# EAGLE design flip_dot_controller V2 - (EAGLE 7.2.0)
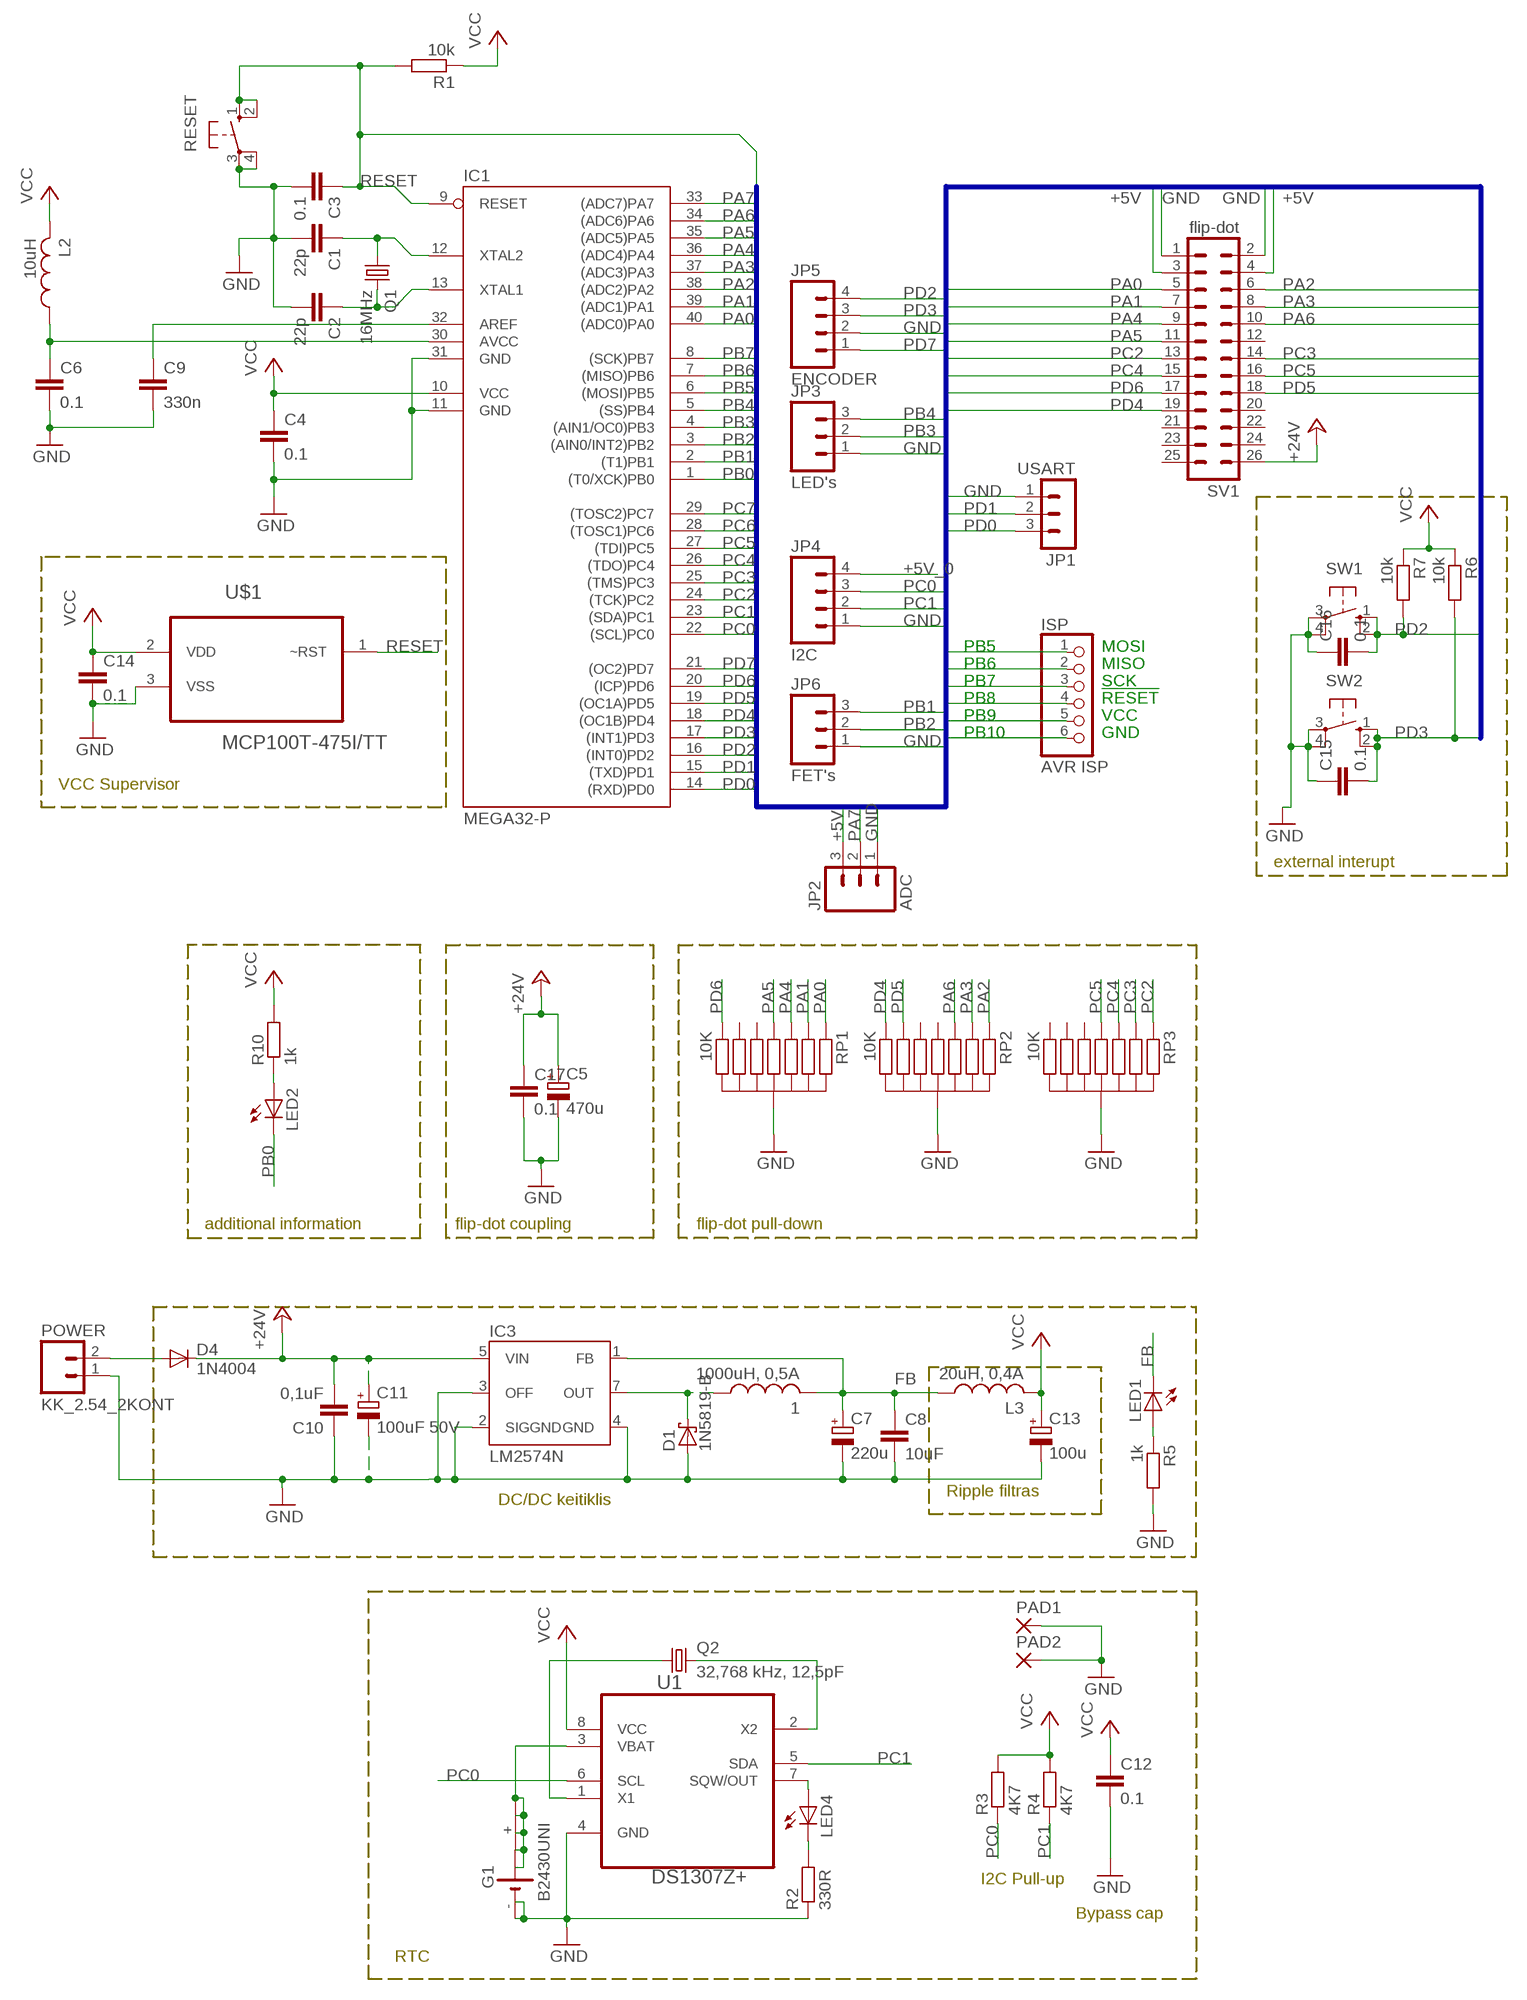
[diagram p0: schematic, sheet 1]

## Parts
1  1000uH, 0,5A  RITE1  [RITE]
C1  22p  C-EUC0805  [C0805]
C2  22p  C-EUC0805  [C0805]
C3  0.1  C-EUC0805  [C0805]
C4  0.1  C-EUC0805K  [C0805K]
C5  470u  CPOL-EUE5-10.5  [E5-10,5]
C6  0.1  C-EUC0805K  [C0805K]
C7  220u  CPOL-EUE5-8.5  [E5-8,5]
C8  10uF  C-EUC0805  [C0805]
C9  330n  C-EUC0805  [C0805]
C10  0,1uF  C-EUC0805K  [C0805K]
C11  100uF 50V  CPOL-EUE5-10.5  [E5-10,5]
C12  0.1  C-EUC0805  [C0805]
C13  100u  CPOL-EUE5-8.5  [E5-8,5]
C14  0.1  C-EUC0805K  [C0805K]
C15  0.1  C-EUC0805K  [C0805K]
C16  0.1  C-EUC0805K  [C0805K]
C17  0.1  C-EUC0805  [C0805]
D1  1N5819-B  [DO41-7.6]
D4  1N4004  [DO41-10]
G1  B2430UNI  [B2430UNI]
IC1  MEGA32-P  MEGA16-P  [DIL40]
IC3  LM2574N  [DIL-08]
ISP  AVR ISP  PINHD-1X6  [1X06]
JP1  USART  MA03-1  [MA03-1]
JP2  ADC  M03LOCK  [1X03_LOCK]
JP3  LED's  M03LOCK  [1X03_LOCK]
JP4  I2C  M04LOCK  [1X04_LOCK]
JP5  ENCODER  M04LOCK  [1X04_LOCK]
JP6  FET's  M03LOCK  [1X03_LOCK]
L2  10uH  L-US0207/5V  [0207/5V]
L3  20uH, 0,4A  L-US0207/5V  [0207/5V]
LED1  LED3MM  [LED3MM]
LED2  LED3MM  [LED3MM]
LED4  LED3MM  [LED3MM]
PAD1  2,15/1,0  [2,15/1,0]
PAD2  2,15/1,0  [2,15/1,0]
POWER  KK_2.54_2KONT  [KONTAKTINE_KALADELE_2.54_2KONT]
Q1  16MHz  CRYSTALHC49S  [HC49/S]
Q2  32,768 kHz, 12,5pF  CRYSTALTC38H  [TC38H]
R1  10k  R-EU_R0805  [R0805]
R2  330R  R-EU_R0805  [R0805]
R3  4K7  R-EU_R0805  [R0805]
R4  4K7  R-EU_R0805  [R0805]
R5  1k  R-EU_R0805  [R0805]
R6  10k  R-EU_R0805  [R0805]
R7  10k  R-EU_R0805  [R0805]
R10  1k  R-EU_R0805  [R0805]
RESET  10-XX  [B3F-10XX]
RP1  10K  1X8_RES_PACK  [1X8_RES_PACK]
RP2  10K  1X8_RES_PACK  [1X8_RES_PACK]
RP3  10K  1X8_RES_PACK  [1X8_RES_PACK]
SV1  flip-dot  ML263M  [3M_26]
SW1  10-XX  [B3F-10XX]
SW2  10-XX  [B3F-10XX]
U1  DS1307Z+  [SOIC127P600X175-8N]
U$1  MCP100T-475I/TT  [SOT95P237X112-3N]

## Nets
+5V: C4.1 C12.1 C13.+ C14.1 IC1.10(VCC) ISP.5 JP2.3 L2.2 L3.2 R1.1 R3.2 R4.2 R6.1 R7.1 R10.2 SV1.3 SV1.4 U1.8(VCC) U$1.2(VDD) ; supply symbol labelled VCC
+5V_0: JP4.4
+24V: C5.+ C10.2 C11.+ C17.1 D4.C IC3.5(VIN) SV1.26
FB: 1.2 C7.+ C8.1 IC3.1(FB) L3.1 LED1.K(C)
GND: C1.2 C2.2 C3.2 C4.2 C5.- C6.2 C7.- C8.2 C9.2 C10.1 C11.- C12.2 C13.- C14.2 C15.1 C16.1 C17.2 D1.A G1.- G1.-@1(-) IC1.11(GND) IC1.31(GND) IC3.2(SIGGND) IC3.3(OFF) IC3.4(GND) ISP.6 JP1.1 JP2.1 JP3.1 JP4.1 JP5.2 JP6.1 PAD1.1(P) PAD2.1(P) POWER.1 R2.1 R5.2 RESET.3(P) RESET.4(P1) RP1.1 RP2.1 RP3.1 SV1.1 SV1.2 SW1.3(P) SW1.4(P1) SW2.3(P) SW2.4(P1) U1.4(GND) U$1.3(VSS)
N$1: C2.1 IC1.13(XTAL1) Q1.2
N$2: C1.1 IC1.12(XTAL2) Q1.1
N$3: C9.1 IC1.32(AREF)
N$4: C6.1 IC1.30(AVCC) L2.1
N$6: Q2.1 U1.1(X1)
N$7: D4.A POWER.2
N$9: Q2.2 U1.2(X2)
N$10: LED4.A U1.7(SQW/OUT)
N$12: LED4.K(C) R2.2
N$13: LED1.A R5.1
N$17: LED2.A R10.1
OUT: 1.1 D1.C IC3.7(OUT)
PA0: IC1.40((ADC0)PA0) RP1.2 SV1.5
PA1: IC1.39((ADC1)PA1) RP1.3 SV1.7
PA2: IC1.38((ADC2)PA2) RP2.2 SV1.6
PA3: IC1.37((ADC3)PA3) RP2.3 SV1.8
PA4: IC1.36((ADC4)PA4) RP1.4 SV1.9
PA5: IC1.35((ADC5)PA5) RP1.5 SV1.11
PA6: IC1.34((ADC6)PA6) RP2.4 SV1.10
PA7: IC1.33((ADC7)PA7) JP2.2
PB0: IC1.1((T0/XCK)PB0) LED2.K(C)
PB1: IC1.2((T1)PB1) JP6.3
PB2: IC1.3((AIN0/INT2)PB2) JP6.2
PB3: IC1.4((AIN1/OC0)PB3) JP3.2
PB4: IC1.5((SS)PB4) JP3.3
PB5: IC1.6((MOSI)PB5) ISP.1
PB6: IC1.7((MISO)PB6) ISP.2
PB7: IC1.8((SCK)PB7) ISP.3
PC0: IC1.22((SCL)PC0) JP4.3 R3.1 U1.6(SCL)
PC1: IC1.23((SDA)PC1) JP4.2 R4.1 U1.5(SDA)
PC2: IC1.24((TCK)PC2) RP3.2 SV1.13
PC3: IC1.25((TMS)PC3) RP3.3 SV1.14
PC4: IC1.26((TDO)PC4) RP3.4 SV1.15
PC5: IC1.27((TDI)PC5) RP3.5 SV1.16
PC6: IC1.28((TOSC1)PC6)
PC7: IC1.29((TOSC2)PC7)
PD0: IC1.14((RXD)PD0) JP1.3
PD1: IC1.15((TXD)PD1) JP1.2
PD2: C16.2 IC1.16((INT0)PD2) JP5.4 R7.2 SW1.1(S) SW1.2(S1)
PD3: C15.2 IC1.17((INT1)PD3) JP5.3 R6.2 SW2.1(S) SW2.2(S1)
PD4: IC1.18((OC1B)PD4) RP2.8 SV1.19
PD5: IC1.19((OC1A)PD5) RP2.7 SV1.18
PD6: IC1.20((ICP)PD6) RP1.8 SV1.17
PD7: IC1.21((OC2)PD7) JP5.1
RESET: C3.1 IC1.9(RESET) ISP.4 R1.2 RESET.1(S) RESET.2(S1) U$1.1(~RST)
VBAT: G1.+ G1.+@1(+) G1.+@2(+) G1.+@3(+) G1.+@4(+) U1.3(VBAT)
Unconnected: RP1.6 RP1.7 RP2.5 RP2.6 RP3.6 RP3.7 RP3.8 SV1.12 SV1.20 SV1.21 SV1.22 SV1.23 SV1.24 SV1.25

## Buses
VCC,GND,VCON,CS1,CS2,RESET,R/W,D/I,EN,VEE,GLED,MISO,SCK,RESET,MOSI,RXD,TXD,PA[0..7],PB[0..7],PC[0..7],PD[0..7]

## Notes on the sheet
- PB5 | MOSI
- PB6 | MISO
- PB7 | SCK
- PB8 | !RESET
- PB9 | VCC
- PB10 | GND
- VCC Supervisor
- external interupt
- additional information | flip-dot coupling | flip-dot pull-down
- Ripple filtras
- DC/DC keitiklis
- I2C Pull-up
- Bypass cap
- RTC

## Library data of the parts
1 = cs5463:RITE
C1-C4 C6 C8-C10 C12 C14-C17 = rcl:C-EU: CAPACITOR, European symbol
C5 C7 C11 C13 = rcl:CPOL-EU: POLARIZED CAPACITOR, European symbol
D1 = diode:1N581*: 1.0A SCHOTTKY BARRIER RECTIFIER Source: http://www.diodes.com/datasheets/ds23001.pdf
D4 = diode:1N4004: DIODE general purpose rectifier, 1 A
G1 = battery:B2430UNI: LI BATTERY
IC1 = atmel:MEGA16-P: MICROCONTROLLER 16 Kbytes FLASH 1 kbytes SRAM 512 bytes EEPROM USART 8-channel 10 bit ADC Source: avr.lbr; MPN: ATMEGA16-16PU; OC_FARNELL: 9171142; OC_NEWARK: 01M6885
IC3 = v-reg-3:LM2574: National Semiconductor <http://www.national.com> 0.5A "Simple Switcher"(c) 52kHz, Vout 1.23-37V (HV: 57V), Vin 40V (HV: 60V), 50µA standby current
ISP = pinhead:PINHD-1X6: PIN HEADER
JP1 = con-lstb:MA03-1: PIN HEADER; OC_FARNELL: unknown; OC_NEWARK: unknown
JP2 JP3 JP6 = SparkFun:M03: Header 3 Standard 3-pin 0.1" header. Use with straight break away headers (SKU : PRT-00116), right angle break away headers (PRT-00553), swiss pins (PRT-00743), machine pins (PRT-00117), and female headers (PRT-00115). Molex polarized connector foot print use with SKU : PRT-08232 with associated crimp pins and housings.
JP4 JP5 = SparkFun:M04: Header 4 Standard 4-pin 0.1" header. Use with straight break away headers (SKU : PRT-00116), right angle break away headers (PRT-00553), swiss pins (PRT-00743), machine pins (PRT-00117), and female headers (PRT-00115). Molex polarized connector foot print use with SKU : PRT-08231 with associated crimp pins and housings. 1MM SMD Version SKU: PRT-10208
L2 L3 = rcl:L-US: INDUCTOR, American symbol
LED1 LED2 LED4 = led:LED: LED OSRAM: - CHIPLED LG R971, LG N971, LY N971, LG Q971, LY Q971, LO R971, LY R971 LH N974, LH R974 LS Q976, LO Q976, LY Q976 LO Q996 - Hyper CHIPLED LW Q18S LB Q993, LB Q99A, LB R99A - SideLED LS A670, LO A670, LY A670, LG A670, LP A670 LB A673, LV A673, LT A673, LW A673 LH A674 LY A675 LS A676, LA A676, LO A676, LY A676, LW A676 LS A679, LY A679, LG A679 - Hyper Micro SIDELED® LS Y876, LA Y876, LO Y876, LY Y876 LT Y87S - SmartLED LW L88C, LW L88S LB L89C, LB L89S, LG L890 LS L89K, LO L89K, LY L89K LS L896, LA L896, LO L896, LY L896 - TOPLED LS T670, LO T670, LY T670, LG T670, LP T670 LSG T670, LSP T670, LSY T670, LOP T670, LYG T670 LG T671, LOG T671, LSG T671 LB T673, LV T673, LT T673, LW T673 LH T674 LS T676, LA T676, LO T676, LY T676, LB T676, LH T676, LSB T676, LW T676 LB T67C, LV T67C, LT T67C, LS T67K, LO T67K, LY T67K, LW E67C LS E67B, LA E67B, LO E67B, LY E67B, LB E67C, LV E67C, LT E67C LW T67C LS T679, LY T679, LG T679 LS T770, LO T770, LY T770, LG T770, LP T770 LB T773, LV T773, LT T773, LW T773 LH T774 LS E675, LA E675, LY E675, LS T675 LS T776, LA T776, LO T776, LY T776, LB T776 LHGB T686 LT T68C, LB T68C - Hyper Mini TOPLED® LB M676 - Mini TOPLED Santana® LG M470 LS M47K, LO M47K, LY M47K Source: http://www.osram.convergy.de LUXEON: - LUMILED® LXK2-PW12-R00, LXK2-PW12-S00, LXK2-PW14-U00, LXK2-PW14-V00 LXK2-PM12-R00, LXK2-PM12-S00, LXK2-PM14-U00 LXK2-PE12-Q00, LXK2-PE12-R00, LXK2-PE12-S00, LXK2-PE14-T00, LXK2-PE14-U00 LXK2-PB12-K00, LXK2-PB12-L00, LXK2-PB12-M00, LXK2-PB14-N00, LXK2-PB14-P00, LXK2-PB14-Q00 LXK2-PR12-L00, LXK2-PR12-M00, LXK2-PR14-Q00, LXK2-PR14-R00 LXK2-PD12-Q00, LXK2-PD12-R00, LXK2-PD12-S00 LXK2-PH12-R00, LXK2-PH12-S00 LXK2-PL12-P00, LXK2-PL12-Q00, LXK2-PL12-R00 Source: www.luxeon.com KINGBRIGHT: KA-3528ASYC Source: www.kingbright.com
PAD1 PAD2 = wirepad:2,15/1,0: THROUGH-HOLE PAD
POWER = ExT:KK_2.54_2KONT
Q1 = crystal:CRYSTAL: CRYSTAL; OC_FARNELL: 1667008; OC_NEWARK: unknown
Q2 = crystal:CRYSTAL: CRYSTAL; OC_FARNELL: unknown; OC_NEWARK: unknown
R1-R7 R10 = rcl:R-EU_: RESISTOR, European symbol
RESET SW1 SW2 = switch-omron:10-XX: OMRON SWITCH; MPN: B3F-1000; OC_FARNELL: 176432; OC_NEWARK: 36M3542
RP1-RP3 = ExT:1X8_RES_PACK
SV1 = con-harting-ml:ML26: HARTING; OC_FARNELL: unknown; OC_NEWARK: unknown
U1 = ds1307:DS1307Z+: 64 x 8, Serial, I2C Real-Time Clock; MPN: DS1307Z+; OC_FARNELL: 9726322; OC_NEWARK: 08J6234; PACKAGE: SOIC-8; SUPPLIER: Maxim
U$1 = MCP100T:MCP100T-475I/TT: Microcontroller Supervisory Circuit; MPN: MCP100T-475I/TT; OC_FARNELL: 9758380; OC_NEWARK: 19C7132; PACKAGE: SOT-3; SUPPLIER: Microchip

## Board
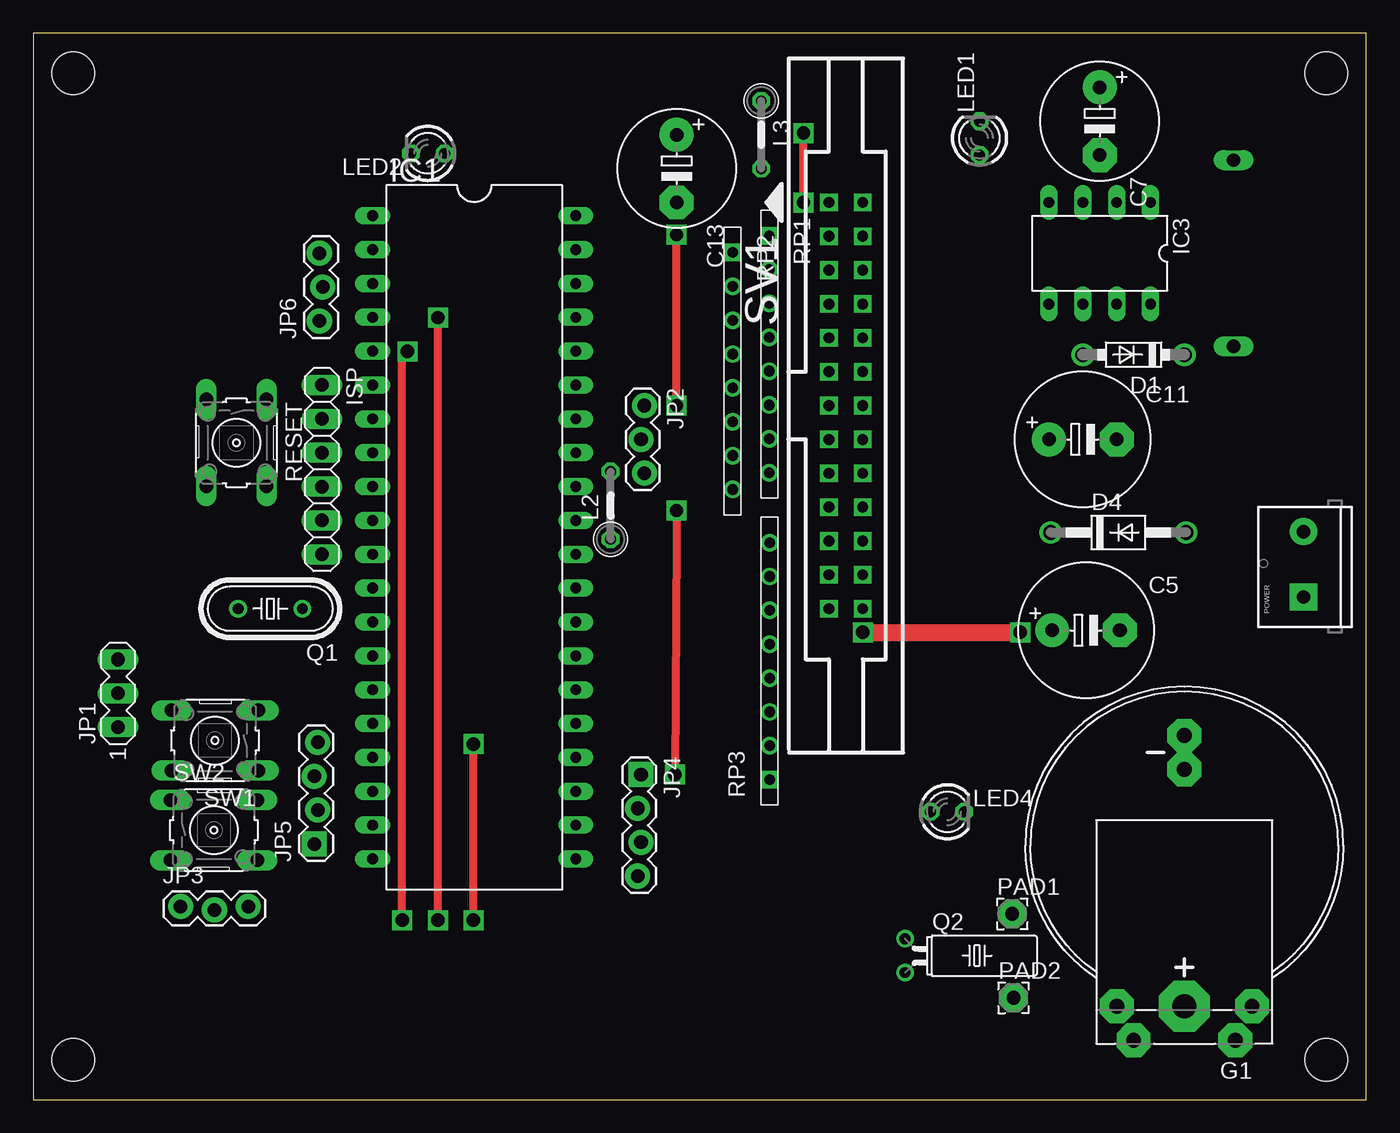
[diagram p1: board, top side]
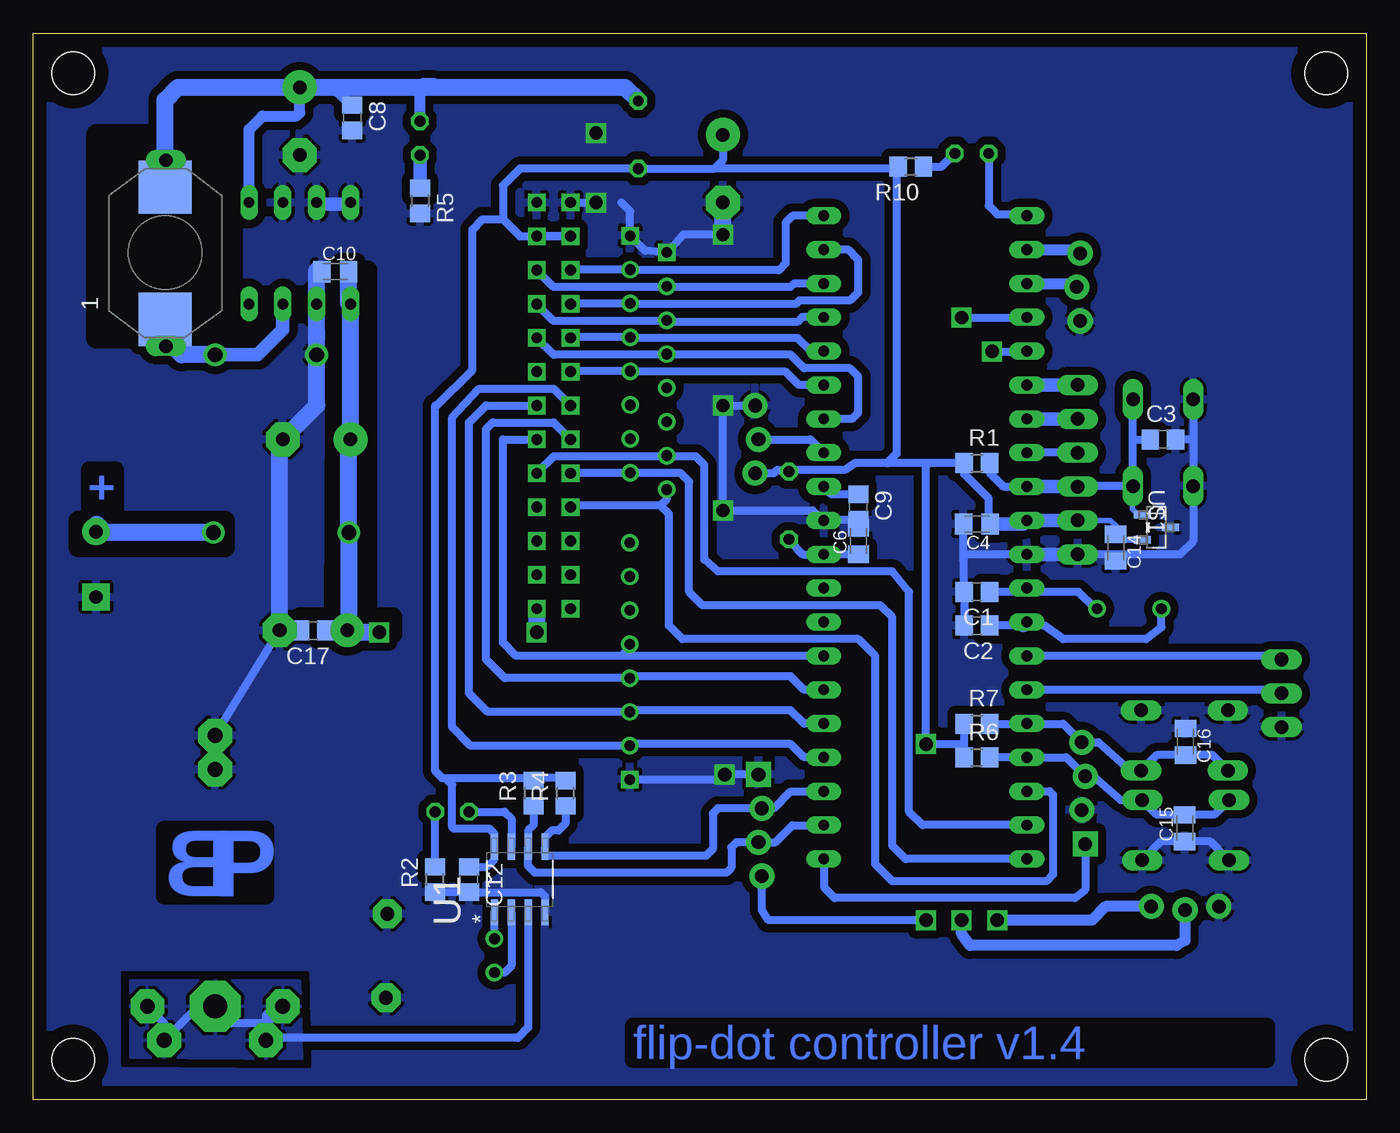
[diagram p2: board, bottom side, seen from below]

Size 100 x 80 mm. Coordinates in mm from the lower left corner, seen from the top.
Outline: 0,0 100,0 100,80 0,80 0,0
Copper layers (1*16): Top 0.035mm / dielectric 1.5mm / Bottom 0.035mm
Design rules "default": minimum track width 10mil, minimum drill 24mil, track to track 8mil, track to pad 8mil, pad to pad 8mil, via to via 8mil, smd to smd 8mil, copper to edge 40mil, drill to drill 8mil, minimum pad ring 10mil, minimum via ring 8mil, stop-mask expansion 4mil, vias tented up to drill 0mil, thermal gap 10mil
Holes 3.2 mm at 97,3 97,77 3,77 3,3
bRestrict: area 85.1,57.1 to 95.2,72.4; area 85.6,41.4 to 96.6,43.4; area 74.9,36.2 to 77.5,59.8; area 74.9,59.7 to 77.5,62.2; area 73,34.9 to 80,36.2

### Footprints (pad centres in the part's own frame; a part is rotated, then mirrored left to right if it is on the bottom)
RITE = smd 4 x 4: 1 1.4,0.7; 2 11.3,0.7 | drill 1 long: 1_1 -0.635,0.635; 2_2 13.335,0.635
C0805 = smd 1.3 x 1.5: 1 -0.95,0; 2 0.95,0
C0805K = smd 1.3 x 1.6: 1 -1,0; 2 1,0
E5-10,5 = drill 1.016 pad 2.54: + -2.54,0 | drill 1.016 pad 2.54 octagon: - 2.54,0
E5-8,5 = drill 1.016 pad 2.54: + -2.54,0 | drill 1.016 pad 2.54 octagon: - 2.54,0
DO41-7.6 = drill 1.1 pad 1.7: A 3.81,0; C -3.81,0
DO41-10 = drill 1.118: A 5.08,0; C -5.08,0
B2430UNI = drill 1.118 pad 2.54 octagon: + 3.81,14.605; +@1 -3.81,14.605; +@2 -5.08,12.065; +@3 5.08,12.065; - 0,-5.715; -@1 0,-8.255 | drill 1.803 pad 3.81 octagon: +@4 0,12.065
DIL40 = drill 0.813 long: 1 -24.13,-7.62; 2 -21.59,-7.62; 3 -19.05,-7.62; 4 -16.51,-7.62; 5 -13.97,-7.62; 6 -11.43,-7.62; 7 -8.89,-7.62; 8 -6.35,-7.62; 9 -3.81,-7.62; 10 -1.27,-7.62; 11 1.27,-7.62; 12 3.81,-7.62; 13 6.35,-7.62; 14 8.89,-7.62; 15 11.43,-7.62; 16 13.97,-7.62; 17 16.51,-7.62; 18 19.05,-7.62; 19 21.59,-7.62; 20 24.13,-7.62; 21 24.13,7.62; 22 21.59,7.62; 23 19.05,7.62; 24 16.51,7.62; 25 13.97,7.62; 26 11.43,7.62; 27 8.89,7.62; 28 6.35,7.62; 29 3.81,7.62; 30 1.27,7.62; 31 -1.27,7.62; 32 -3.81,7.62; 33 -6.35,7.62; 34 -8.89,7.62; 35 -11.43,7.62; 36 -13.97,7.62; 37 -16.51,7.62; 38 -19.05,7.62; 39 -21.59,7.62; 40 -24.13,7.62
DIL-08 = drill 0.813 long: 1 -3.81,-3.81; 2 -1.27,-3.81; 3 1.27,-3.81; 4 3.81,-3.81; 5 3.81,3.81; 6 1.27,3.81; 7 -1.27,3.81; 8 -3.81,3.81
1X06 = drill 1.016 long: 1 -6.35,0; 2 -3.81,0; 3 -1.27,0; 4 1.27,0; 5 3.81,0; 6 6.35,0
MA03-1 = drill 1.016 long: 1 -2.54,0; 2 0,0; 3 2.54,0
1X03_LOCK = drill 1.016 pad 1.88: 1 0,0.127; 2 2.54,-0.127; 3 5.08,0.127
1X04_LOCK = drill 1.016 pad 1.88 square: 1 0,0.127 | drill 1.016 pad 1.88: 2 2.54,-0.127; 3 5.08,0.127; 4 7.62,-0.127
0207/5V = drill 0.813 octagon: 1 -2.54,0; 2 2.54,0
LED3MM = drill 0.813 octagon: A -1.27,0; K 1.27,0
2,15/1,0 = drill 1.016 pad 2.159 octagon: 1 0,0
KONTAKTINE_KALADELE_2.54_2KONT = drill 1 pad 2.032 square: 1 0,0 | drill 1 pad 2.032: 2 4.9,0
HC49/S = drill 0.813: 1 -2.413,0; 2 2.413,0
TC38H = drill 0.813: 1 -1.27,0; 2 1.27,0
R0805 = smd 1.3 x 1.5: 1 -0.95,0; 2 0.95,0
B3F-10XX = drill 1.016 long: 1 -3.251,2.261; 2 3.251,2.261; 3 -3.251,-2.261; 4 3.251,-2.261
1X8_RES_PACK = drill 0.8 square: 1 0,0 | drill 0.8: 2 2.54,0; 3 5.08,0; 4 7.62,0; 5 10.16,0; 6 12.7,0; 7 15.24,0; 8 17.78,0
3M_26 = drill 0.813 square: 1 -15.24,-1.27; 2 -15.24,1.27; 3 -12.7,-1.27; 4 -12.7,1.27; 5 -10.16,-1.27; 6 -10.16,1.27; 7 -7.62,-1.27; 8 -7.62,1.27; 9 -5.08,-1.27; 10 -5.08,1.27; 11 -2.54,-1.27; 12 -2.54,1.27; 13 0,-1.27; 14 0,1.27; 15 2.54,-1.27; 16 2.54,1.27; 17 5.08,-1.27; 18 5.08,1.27; 19 7.62,-1.27; 20 7.62,1.27; 21 10.16,-1.27; 22 10.16,1.27; 23 12.7,-1.27; 24 12.7,1.27; 25 15.24,-1.27; 26 15.24,1.27
SOIC127P600X175-8N = smd 1.981 x 0.533: 1 -2.464,1.905; 2 -2.464,0.635; 3 -2.464,-0.635; 4 -2.464,-1.905; 5 2.464,-1.905; 6 2.464,-0.635; 7 2.464,0.635; 8 2.464,1.905
SOT95P237X112-3N = smd 0.559 x 1.27: 1 -0.94,-1.041; 2 0.94,-1.041; 3 0,1.041

### Placement (x,y rotation side)
1  89.41,57.15 90 bottom
C1  29.21,38.1 180 bottom
C2  29.21,35.56 180 bottom
C3  15.24,49.53 0 bottom
C4  29.21,43.18 180 bottom
C5  78.98,35.21 0 top
C6  38.1,41.91 90 bottom
C7  80.01,73.41 270 top
C8  76.07,73.66 270 bottom
C9  38.1,44.45 270 bottom
C10  77.34,62.1 0 bottom
C11  78.74,49.53 0 top
C12  67.31,16.51 270 bottom
C13  48.26,69.85 270 top
C14  18.8,41.4 270 bottom
C15  13.62,20.36 90 bottom
C16  13.56,26.84 270 bottom
C17  78.99,35.18 180 bottom
D1  82.55,55.88 180 top
D4  81.41,42.55 0 top
G1  86.36,19.05 180 top
IC1  33.08,42.18 270 top
IC3  80.01,63.5 180 top
ISP  21.65,47.26 270 top
JP1  6.35,30.48 90 top
JP2  45.72,52.07 270 top
JP3  11.05,14.35 0 top
JP4  45.47,24.38 270 top
JP5  21.21,19.18 90 top
JP6  21.59,58.42 90 top
L2  43.31,44.58 90 top
L3  54.61,72.39 270 top
LED1  70.99,72.14 90 top
LED2  29.59,70.99 180 top
LED4  68.58,21.59 0 top
PAD1  73.44,13.93 0 top
PAD2  73.54,7.63 0 top
POWER  95.3,37.71 90 top
Q1  17.78,36.83 180 top
Q2  65.41,10.79 270 top
R1  29.21,47.75 0 bottom
R2  69.85,16.51 90 bottom
R3  62.48,22.99 90 bottom
R4  60.07,22.99 90 bottom
R5  70.99,67.44 270 bottom
R6  29.21,25.65 0 bottom
R7  29.21,28.19 0 bottom
R10  34.16,69.98 180 bottom
RESET  15.24,49.28 270 top
RP1  55.22,64.81 270 top
RP2  52.47,63.55 270 top
RP3  55.24,24 90 top
SV1  60.96,52.07 270 top
SW1  13.63,26.94 180 top
SW2  13.55,20.21 0 top
U1  63.5,16.51 90 bottom
U$1  15.75,42.93 270 bottom

### Tracks (layer width: path | path; a pad name or v marks a point on that pad's centre or on a via)
+5V  (via drill 1)
  Top 0.61: v33.02,13.46 v33.02,26.67
  Bottom 0.406: U$1.2 18.38,41.99 C14.1 18.8,43.05 19.18,43.43 21.63,43.43 ISP.5
  Bottom 0.61: SV1.4 SV1.3 63.5,64.77 64.77,66.04 | R1.1 30.16,46.92 28.32,45.09 28.32,43.29 C4.1 | R1.1 33.02,47.75 | 33.02,47.75 35.94,47.75 | 35.94,47.75 38.35,47.75 39.12,47.24 43.43,47.24 | 64.77,66.04 64.77,68.58 63.5,69.85 L3.2 48.9,69.85 | R1.1 30.48,48.07 | 43.18,46.99 L2.2 43.43,47.24 | JP2.3 44.45,46.99 44.2,47.24 43.43,47.24 | C13.+ 48.26,70.48 48.9,69.85 | 33.02,47.75 32.89,47.62 33.02,47.62 v33.02,26.67 30.16,26.67 | C12.1 65.98,17.46 65.41,18.03 U1.8 65.41,19.94 65.79,20.32 68.45,20.32 68.58,20.45 68.58,23.62 69.09,24.13 | 69.85,51.94 67.06,54.74 67.06,65.28 66.29,66.04 64.77,66.04 | 69.85,51.94 69.85,24.64 69.34,24.13 69.09,24.13 | 69.85,51.94 69.85,52.07 | 69.09,24.13 62.29,24.13 | R4.2 60.26,24.13 62.29,24.13 | 62.29,24.13 R3.2 | 35.24,69.85 48.9,69.85 | R6.1 30.16,26.67 | 30.16,26.67 R7.1 | v33.02,13.46 44.83,13.46 45.34,14.22 45.34,16.38 45.59,16.64 45.47,16.76 | 35.24,69.85 R10.2 | 35.24,69.85 35.24,48.45 35.94,47.75
  Bottom 1.016: ISP.5 IC1.10 25.73,43.18 C4.1
+24V  (via drill 1)
  Top 1.27: v62.23,35.05 v74.04,35.05
  Bottom 1.27: C5.+ 76.44,35.94 77.2,35.18 C17.1 | C5.+ 76.33,35.32 D4.C 76.33,49.4 C11.+ IC3.5 76.34,59.69 C10.2 | SV1.26 v62.23,35.05 | v74.04,35.05 76.28,35.05 C5.+
FB
  Bottom 0.813: 80.01,76.07 C7.+ 80.01,74.04 80.26,73.79 82.8,73.79 83.82,72.77 IC3.1 | C8.1 77.34,75.82 77.47,75.95 | LED1.K 70.99,76.07 | 70.99,76.07 69.85,76.2 70.87,76.2 70.99,76.07 | 70.99,76.07 71.12,75.95
  Bottom 1.27: L3.1 55.63,75.95 71.12,75.95 77.47,75.95 C7.+ 89.15,75.95 90.11,74.99 1.2
GND  (via drill 1, 1 pad 0.81)
  Top 0.61: v48.13,24.38 48.26,42.04 v48.26,44.2 | v48.26,52.07 v48.26,64.9 | v57.78,67.31 v57.78,72.52
  Bottom 0.61: C2.2 C1.2 30.23,38.17 30.23,40.51 | 37.78,43.18 C9.2 | C9.2 40.65,43.5 IC1.31 40.72,43.43 40.77,43.43 41.53,44.2 v48.26,44.2 v48.26,52.07 45.72,52.07 | 55.88,67.31 55.22,66.65 RP1.1 54.09,63.68 RP2.1 51.25,64.9 v48.26,64.9 | C9.2 C6.2 | SW2.3 11.71,19.36 C15.1 15.39,19.36 SW2.4 | IC1.11 29.96,40.91 30.23,40.64 30.23,40.51 | C4.2 30.21,40.53 30.23,40.51 | ISP.6 21.63,40.89 13.97,40.89 12.98,41.88 RESET.4 12.98,49.53 | RESET.3 12.98,49.53 | 12.98,49.53 C3.2 | RP3.1 48.39,24 48.26,24.13 | 48.26,24.13 48.26,24.26 v48.13,24.38 | U1.4 61.59,15.24 61.91,15.56 C12.2 R2.1 69.85,15.24 | JP4.1 48.01,24.38 48.26,24.13 | C5.- 81.52,35.32 81.28,35.56 G1.-@1 G1.- | SV1.1 v57.78,67.31 | v57.78,72.52 57.78,72.77
  Bottom 1.016: ISP.6 IC1.11 | 78.61,67.18 76.33,67.18 IC3.4
  Bottom 1.27: C5.- 81.79,34.94 81.79,34.67 81.52,34.94 C5.- | C17.2 81.49,35.18 C5.- | v48.26,64.9 C13.- | C5.- 81.52,49.29 C11.- 78.74,52.07 D1.A 78.74,62.1 | C10.1 78.74,62.1 | 78.74,62.1 78.74,62.23
  pour Bottom (isolate 0.61, rank 6): 0,80.01 100.33,80.01 100.33,0 0,0
N$1
  Bottom 0.61: Q1.2 15.37,35.43 16.51,34.54 22.73,34.54 24.13,35.56 25.19,35.56 IC1.13 | 25.73,35.56 C2.1
  Bottom 1.016: IC1.13 25.73,35.56
N$2
  Bottom 0.61: 20.32,36.83 21.59,38.1 25.19,38.1 IC1.12 25.73,38.1 C1.1
  Bottom 1.016: Q1.1 20.32,36.83
N$3
  Bottom 0.61: C9.1 40.11,45.4 IC1.32
N$4
  Bottom 0.61: C6.1 IC1.30 40.72,40.89 42.29,40.89 42.67,41.27 L2.1
N$6
  Bottom 0.61: Q2.1 U1.1
N$7
  Bottom 1.27: D4.A 94.61,42.55 95.25,43.18 95.25,42.66 POWER.2
N$9
  Bottom 0.61: U1.2 64.14,10.03 64.64,9.53 Q2.2
N$10
  Bottom 0.61: LED4.A 64.64,21.59 64.14,21.08 U1.7
N$12
  Bottom 0.61: R2.2 LED4.K
N$13
  Bottom 1.016: R5.1 LED1.A
N$17
  Bottom 0.61: R10.1 31.88,69.98 LED2.A
OUT
  Bottom 1.016: D1.C 83.19,55.88 81.28,57.78 IC3.7
  Bottom 1.27: D1.C 88.9,55.88 90.17,57.15 90.17,58.42 90.11,58.48 1.1
PA0
  Bottom 0.61: IC1.40 43.04,66.31 43.56,65.79 43.56,62.74 44.07,62.23 55.18,62.23 RP1.2 59.65,62.27 SV1.5
PA1
  Bottom 0.61: IC1.39 40.68,63.75 38.86,63.75 38.1,62.99 38.1,60.58 38.73,59.94 42.55,59.94 42.8,59.69 55.18,59.69 RP1.3 59.65,59.73 SV1.7
PA2
  Bottom 0.61: IC1.38 42.91,61.23 43.18,60.96 52.29,60.96 RP2.2 52.52,61.14 52.7,60.96 60.96,60.96 SV1.6
PA3
  Bottom 0.61: IC1.37 42.34,58.69 42.68,58.35 52.22,58.35 RP2.3 52.65,58.6 52.83,58.42 60.96,58.42 SV1.8
PA4
  Bottom 0.61: IC1.36 41.67,56.15 42.67,57.15 55.18,57.15 RP1.4 59.65,57.19 SV1.9
PA5
  Bottom 0.61: IC1.35 42.56,53.61 43.56,54.61 55.18,54.61 RP1.5 59.65,54.65 SV1.11
PA6
  Bottom 0.61: IC1.34 38.59,51.07 38.1,51.56 38.1,54.23 38.73,54.86 42.16,54.86 43.18,55.88 52.29,55.88 RP2.4 52.65,56.06 52.83,55.88 60.96,55.88 SV1.10
PA7
  Bottom 0.61: JP2.2 41.7,49.53 IC1.33
PB0
  Bottom 0.61: LED2.K 28.32,67.06 27.69,66.42 25.57,66.42 IC1.1
PB1
  Bottom 0.813: IC1.2 21.73,63.77 JP6.3
PB2
  Bottom 0.813: IC1.3 21.99,61.23 JP6.2
PB3  (via drill 1)
  Top 0.61: v30.35,13.46 v30.35,58.67
  Bottom 0.61: v30.35,58.67 25.48,58.67 IC1.4
  Bottom 0.813: JP3.2 13.59,11.94 14.22,11.56 29.72,11.56 30.35,12.45 v30.35,13.46
PB4  (via drill 1)
  Top 0.61: v27.69,13.46 27.69,55.75 v28.07,56.13
  Bottom 0.61: v28.07,56.13 25.48,56.13 IC1.5
  Bottom 0.813: JP3.3 19.56,14.48 20.57,13.46 v27.69,13.46
PB5
  Bottom 1.016: ISP.1 IC1.6
PB6
  Bottom 1.016: ISP.2 IC1.7
PB7
  Bottom 0.61: ISP.3 25.42,48.53 | 25.42,48.53 25.53,48.64 | IC1.8 25.42,48.53
PC0
  Bottom 0.61: IC1.22 40.72,20.57 43.05,20.57 44.32,19.3 JP4.3 47.24,19.3 47.62,18.92 47.62,17.4 48.01,17.02 62.36,17.02 62.87,17.53 U1.6 62.87,20.19 62.48,20.57 R3.1
PC1
  Bottom 0.61: 45.21,21.84 JP4.2 48.64,21.84 49.02,21.46 49.02,18.8 49.53,18.29 61.47,18.29 61.59,18.41 U1.5 61.59,19.68 61.09,20.19 60.58,20.19 60.07,20.7 R4.1 | 45.21,21.84 44.45,21.84 43.18,23.11 40.72,23.11 IC1.23 | 45.34,21.97 45.21,21.84
PC2
  Bottom 0.61: IC1.24 42.18,25.67 43.18,26.67 55.12,26.67 RP3.2 67.18,26.54 68.58,27.94 68.58,51.18 66.55,53.34 60.96,53.34 SV1.13
PC3
  Bottom 0.61: IC1.25 42.18,28.21 43.18,29.21 55.12,29.21 RP3.3 65.91,29.08 67.31,30.48 67.31,50.8 66.04,52.07 SV1.14
PC4
  Bottom 0.61: IC1.26 42.18,30.75 43.18,31.75 55.12,31.75 RP3.4 64.64,31.62 66.04,33.02 66.04,50.29 65.53,50.8 60.96,50.8 SV1.15
PC5
  Bottom 0.61: SV1.16 64.77,49.53 64.77,34.29 63.77,33.29 55.88,33.29 | IC1.27 55.88,33.29 | RP3.5 55.24,33.92 55.88,33.29
PD0
  Bottom 0.61: IC1.14 6.62,33.29 JP1.3
PD1
  Bottom 0.61: IC1.15 6.62,30.75 JP1.2 6.28,30.55
PD2
  Bottom 0.61: R7.2 25.48,28.19 | 25.48,28.19 IC1.16 | 10.32,24.62 SW1.2 | SW1.2 11.54,25.84 C16.2 15.72,25.84 SW1.1 16.92,24.64 17.65,24.64 20.07,26.8 JP5.4 22.73,28.19 25.48,28.19 | 10.34,24.64 SW1.2 | 10.16,24.89 SW1.2 | 10.18,24.88 SW1.2
PD3
  Bottom 0.61: SW2.1 11.41,21.36 C15.2 15.69,21.36 SW2.2 18.41,22.48 20.45,24.26 JP5.3 22.5,25.67 IC1.17 28.24,25.67 R6.2
PD4
  Bottom 0.61: 52.96,44.58 52.32,43.94 52.32,35.56 51.31,34.54 38.1,34.54 36.83,33.27 36.83,17.65 35.56,16.38 24,16.38 23.5,16.89 23.5,22.86 23.77,23.13 IC1.18 | RP2.8 52.47,45.07 52.96,44.58 | 52.96,44.58 59.56,44.58 SV1.19
PD5
  Bottom 0.61: SV1.18 60.96,48.26 52.7,48.26 52.52,48.44 RP2.7 52.29,48.26 50.29,48.26 49.66,47.62 49.66,40.51 48.64,39.62 35.56,39.62 34.29,38.1 34.29,21.59 33.29,20.59 IC1.19
PD6
  Bottom 0.61: 55.18,46.99 51.44,46.99 50.8,46.35 50.8,38.1 49.78,37.08 36.45,37.08 35.56,36.2 35.56,19.05 34.56,18.05 IC1.20 | 55.18,46.99 RP1.8 | 55.18,46.99 SV1.17
PD7
  Bottom 0.61: IC1.21 40.64,17.99 40.64,15.88 39.88,15.11 21.84,15.11 21.08,15.75 JP5.1
RESET
  Bottom 0.406: U$1.1 17.07,43.87 17.53,44.32 17.53,45.97 17.5,46 | 17.5,46 17.4,46.1 | RESET.2 17.5,46
  Bottom 0.61: ISP.4 21.61,46.02 RESET.2 17.5,49.53 | 17.5,49.53 RESET.1 | 17.5,49.53 C3.1 | R1.2 28.26,47.06 27.18,45.97 25.48,45.97 IC1.9
  Bottom 1.016: ISP.4 IC1.9
VBAT
  Bottom 0.61: G1.+ 82.55,5.08 | 82.55,5.08 82.55,5.71 | 82.55,5.71 82.27,6 | 82.27,6 G1.+@3 | G1.+@2 90.17,5.71 G1.+@1 87.63,6.99 G1.+@4 85.09,5.71 82.55,5.71 | G1.+@3 81.41,7.11 | G1.+@3 80.77,7.49 81.15,7.49 81.28,7.62 82.55,6.35 82.55,5.71 | U1.3 62.87,5.41 63.64,4.63 82.1,4.63 82.55,5.08 | 82.24,5.9 82.34,6 82.27,6
  pour Bottom (isolate 0.61): 80.01,8.89 92.71,8.89 92.71,3.17 79.88,3.05

### Text on the board
Bottom: + | B | P | flip-dot controller v1.4